# EAGLE design untitled (EAGLE 7.6.0)
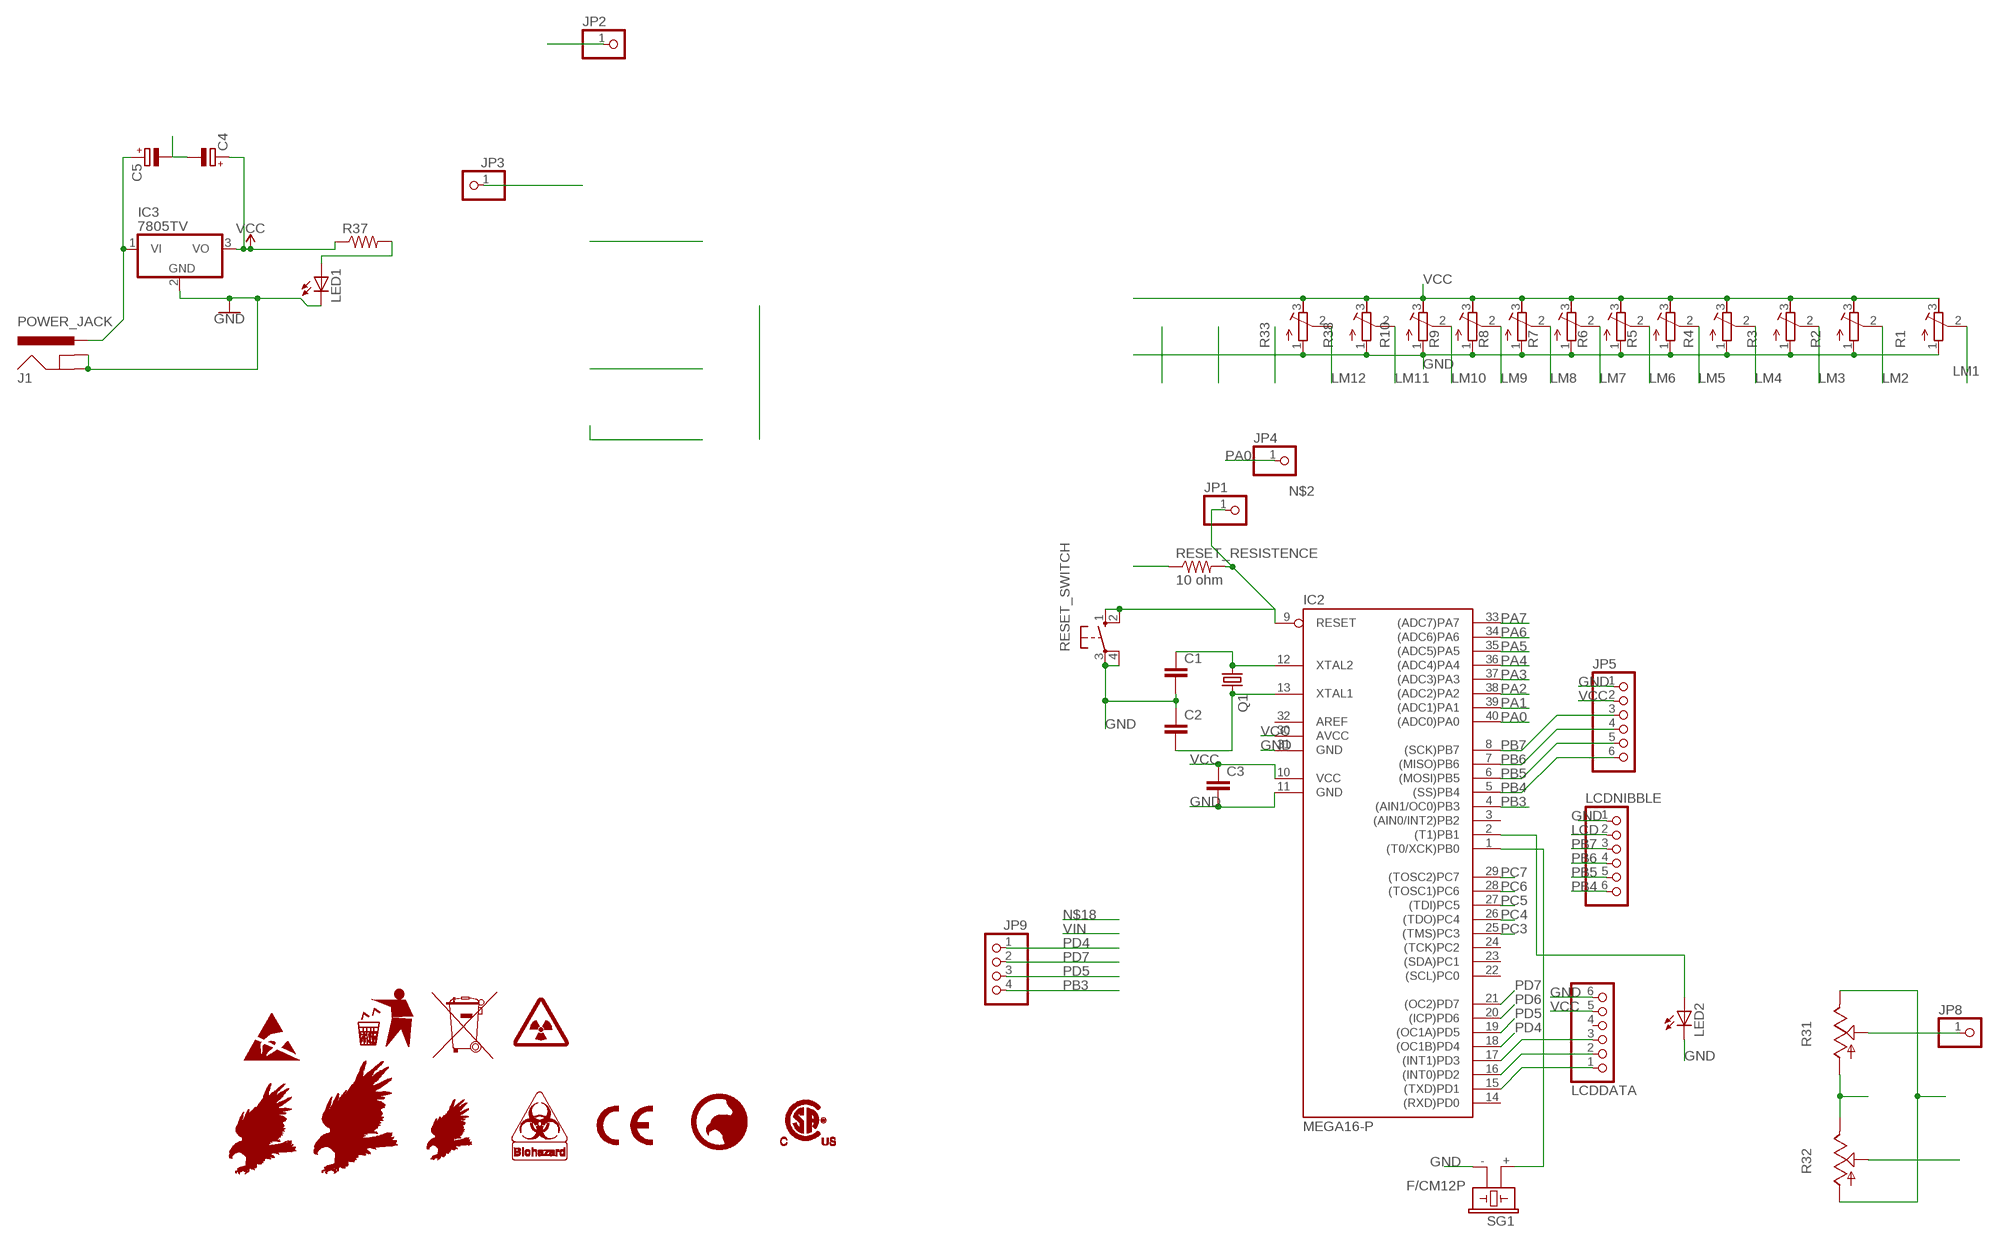
[diagram p0: schematic, sheet 1, part 1 of 2]
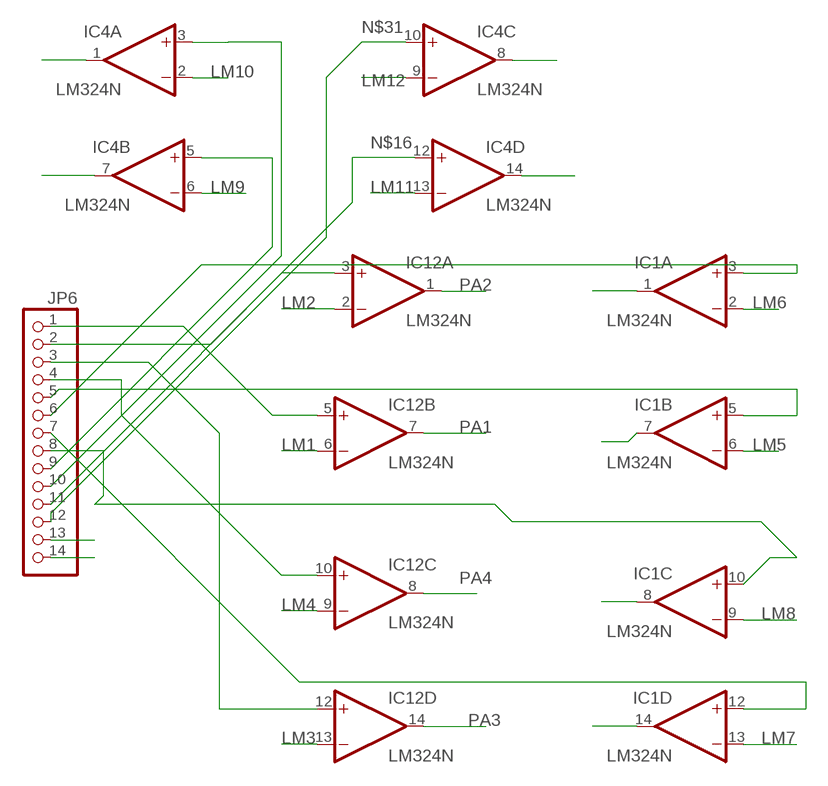
[diagram p1: schematic, sheet 1, part 2 of 2]

## Parts
C1  C-EU025-025X050  [C025-025X050]
C2  C-EU025-025X050  [C025-025X050]
C3  C-EU050-030X075  [C050-030X075]
C4  CPOL-EUE2.5-6  [E2,5-6]
C5  CPOL-EUE2.5-6  [E2,5-6]
IC1  LM324N  [DIL14]
IC2  MEGA16-P  [DIL40]
IC3  7805TV  [TO220V]
IC4  LM324N  [DIL14]
IC12  LM324N  [DIL14]
J1  POWER_JACK  [POWER_JACK_PTH]
JP1  PINHD-1X1  [1X01]
JP2  PINHD-1X1  [1X01]
JP3  PINHD-1X1  [1X01]
JP4  PINHD-1X1  [1X01]
JP5  PINHD-1X6  [1X06]
JP6  PINHD-1X14/90  [1X14/90]
JP8  PINHD-1X1  [1X01]
JP9  PINHD-1X4  [1X04]
LCDDATA  PINHD-1X6  [1X06]
LCDNIBBLE  PINHD-1X6  [1X06]
LED1  LED5MM  [LED5MM]
LED2  LED5MM  [LED5MM]
Q1  CRYSTALHC49U70  [HC49U70]
R1  R-TRIMM64W  [RTRIM64W]
R2  R-TRIMM64W  [RTRIM64W]
R3  R-TRIMM64W  [RTRIM64W]
R4  R-TRIMM64W  [RTRIM64W]
R5  R-TRIMM64W  [RTRIM64W]
R6  R-TRIMM64W  [RTRIM64W]
R7  R-TRIMM64W  [RTRIM64W]
R8  R-TRIMM64W  [RTRIM64W]
R9  R-TRIMM64W  [RTRIM64W]
R10  R-TRIMM64W  [RTRIM64W]
R31  TRIM_US-CA9V  [CA9V]
R32  TRIM_US-CA9V  [CA9V]
R33  R-TRIMM64W  [RTRIM64W]
R37  R-US_0204/7  [0204/7]
R38  R-TRIMM64W  [RTRIM64W]
RESET_RESISTENCE  10 ohm  R-US_0204/7  [0204/7]
RESET_SWITCH  10-XX  [B3F-10XX]
SG1  F/CM12P  [F/CM12P]

## Nets
GND: C1.2 C2.1 C3.2 C4.- C5.- IC2.11(GND) IC2.31(GND) IC3.2(GND) J1.GND J1.GNDBREAK JP2.1 JP5.1 JP6.14 LCDDATA.6 LCDNIBBLE.1 LED1.K(C) LED2.K(C) R1.1(A) R2.1(A) R3.1(A) R4.1(A) R5.1(A) R6.1(A) R7.1(A) R8.1(A) R9.1(A) R10.1(A) R31.A R32.E R33.1(A) R38.1(A) RESET_SWITCH.3(P) RESET_SWITCH.4(P1) SG1.-
LCD: LCDNIBBLE.2 R32.S
LM1: IC12.6(B:-IN) R1.2(S)
LM2: IC12.2(A:-IN) R2.2(S)
LM3: IC12.13(D:-IN) R3.2(S)
LM4: IC12.9(C:-IN) R4.2(S)
LM5: IC1.6(B:-IN) R5.2(S)
LM6: IC1.2(A:-IN) R6.2(S)
LM7: IC1.13(D:-IN) R7.2(S)
LM8: IC1.9(C:-IN) R8.2(S)
LM9: IC4.6(B:-IN) R9.2(S)
LM10: IC4.2(A:-IN) R10.2(S)
LM11: IC4.13(D:-IN) R38.2(S)
LM12: IC4.9(C:-IN) R33.2(S)
N$2: IC2.9(RESET) JP1.1 RESET_RESISTENCE.2 RESET_SWITCH.1(S) RESET_SWITCH.2(S1)
N$4: IC1.10(C:+IN) JP6.8
N$5: C1.1 IC2.12(XTAL2) Q1.1
N$6: C2.2 IC2.13(XTAL1) Q1.2
N$8: IC2.15((TXD)PD1) LCDDATA.1
N$9: IC2.16((INT0)PD2) LCDDATA.2
N$10: IC2.17((INT1)PD3) LCDDATA.3
N$11: IC12.12(D:+IN) JP6.3
N$13: IC12.10(C:+IN) JP6.4
N$14: IC12.5(B:+IN) JP6.1
N$15: IC12.3(A:+IN) JP6.2
N$16: IC4.12(D:+IN) JP6.11
N$19: C5.+ IC3.1(VI) J1.PWR
N$20: JP8.1 R31.S
N$22: LED1.A R37.2
N$23: IC2.1((T0/XCK)PB0) SG1.+
N$26: IC2.2((T1)PB1) LED2.A
N$31: IC4.10(C:+IN) JP6.12
N$33: IC1.3(A:+IN) JP6.6
N$35: IC1.5(B:+IN) JP6.5
N$39: IC1.12(D:+IN) JP6.7
N$41: IC4.3(A:+IN) JP6.10
N$43: IC4.5(B:+IN) JP6.9
PA0: IC2.40((ADC0)PA0) JP4.1
PA1: IC2.39((ADC1)PA1) IC12.7(B:OUT)
PA2: IC2.38((ADC2)PA2) IC12.1(A:OUT)
PA3: IC2.37((ADC3)PA3) IC12.14(D:OUT)
PA4: IC2.36((ADC4)PA4) IC12.8(C:OUT)
PA5: IC1.7(B:OUT) IC2.35((ADC5)PA5)
PA6: IC1.1(A:OUT) IC2.34((ADC6)PA6)
PA7: IC1.14(D:OUT) IC2.33((ADC7)PA7)
PB3: IC2.4((AIN1/OC0)PB3) JP9.4
PB4: IC2.5((SS)PB4) JP5.6 LCDNIBBLE.6
PB5: IC2.6((MOSI)PB5) JP5.5 LCDNIBBLE.5
PB6: IC2.7((MISO)PB6) JP5.4 LCDNIBBLE.4
PB7: IC2.8((SCK)PB7) JP5.3 LCDNIBBLE.3
PC3: IC2.25((TMS)PC3) IC4.8(C:OUT)
PC4: IC2.26((TDO)PC4) IC4.14(D:OUT)
PC5: IC2.27((TDI)PC5) IC4.1(A:OUT)
PC6: IC2.28((TOSC1)PC6) IC4.7(B:OUT)
PC7: IC1.8(C:OUT) IC2.29((TOSC2)PC7)
PD4: IC2.18((OC1B)PD4) JP9.1
PD5: IC2.19((OC1A)PD5) JP9.3
PD6: IC2.20((ICP)PD6)
PD7: IC2.21((OC2)PD7) JP9.2
VCC: C3.1 C4.+ IC2.10(VCC) IC2.30(AVCC) IC3.3(VO) JP3.1 JP5.2 JP6.13 LCDDATA.5 R1.3(E) R2.3(E) R3.3(E) R4.3(E) R5.3(E) R6.3(E) R7.3(E) R8.3(E) R9.3(E) R10.3(E) R31.E R32.A R33.3(E) R37.1 R38.3(E) RESET_RESISTENCE.1
Unconnected: IC2.3((AIN0/INT2)PB2) IC2.14((RXD)PD0) IC2.22((SCL)PC0) IC2.23((SDA)PC1) IC2.24((TCK)PC2) IC2.32(AREF) LCDDATA.4

## Power pins joined to a net without a drawn wire
V+: IC1.4(P:V+) IC4.4(P:V+) IC12.4(P:V+)
V-: IC1.11(P:V-) IC4.11(P:V-) IC12.11(P:V-)

## Library data of the parts
C1 C2 = resistor:C-EU: CAPACITOR, European symbol
C3 = rcl:C-EU: CAPACITOR, European symbol
C4 C5 = resistor:CPOL-EU: POLARIZED CAPACITOR, European symbol
IC1 IC4 IC12 = linear:LM324: OP AMP
IC2 = atmel:MEGA16-P: MICROCONTROLLER 16 Kbytes FLASH 1 kbytes SRAM 512 bytes EEPROM USART 8-channel 10 bit ADC Source: avr.lbr; MPN: ATMEGA16-16PU; OC_FARNELL: 9171142; OC_NEWARK: 01M6885
IC3 = linear:78*: Positive VOLTAGE REGULATOR Source: http://cache.national.com/ds/LM/LM78L05.pdf http://www.fairchildsemi.com/ds/LM/LM7805.pdf
J1 = SparkFun-Connectors:POWER_JACK: Power Jack Connector This is the standard 5.5mm barrel jack for power. The PTH is the most common, proven, reliable, footprint. The Slot footprint only works if the mill layer is transmitted to the PCB fab house so be warned. Here are the connectors we sell at SparkFun: DC Barrel Power Jack/Connector <https://www.sparkfun.com/products/119> (PRT-00119) DC Barrel Power Jack/Connector (SMD) <https://www.sparkfun.com/products/12748> (PRT-12748) DC Barrel Jack Adapter - Breadboard Compatible <https://www.sparkfun.com/products/10811> (PRT-10811) It is used on this SparkFun product (and many, many others): SparkFun RedBoard - Programmed with Arduino <https://www.sparkfun.com/products/12757> (DEV-12757) Also, if you need a mating power supply or connector, please check these out: Wall Adapter Power Supply - 9VDC 650mA <https://www.sparkfun.com/products/298> (TOL-00298) DC Barrel Jack Adapter - Male <https://www.sparkfun.com/products/10287> (PRT-10287); PROD_ID: CONN-08197
JP1-JP4 JP8 = pinhead:PINHD-1X1: PIN HEADER
JP5 LCDDATA LCDNIBBLE = pinhead:PINHD-1X6: PIN HEADER
JP6 = pinhead:PINHD-1X14: PIN HEADER
JP9 = pinhead:PINHD-1X4: PIN HEADER
LED1 LED2 = led:LED: LED OSRAM: - CHIPLED LG R971, LG N971, LY N971, LG Q971, LY Q971, LO R971, LY R971 LH N974, LH R974 LS Q976, LO Q976, LY Q976 LO Q996 - Hyper CHIPLED LW Q18S LB Q993, LB Q99A, LB R99A - SideLED LS A670, LO A670, LY A670, LG A670, LP A670 LB A673, LV A673, LT A673, LW A673 LH A674 LY A675 LS A676, LA A676, LO A676, LY A676, LW A676 LS A679, LY A679, LG A679 - Hyper Micro SIDELED® LS Y876, LA Y876, LO Y876, LY Y876 LT Y87S - SmartLED LW L88C, LW L88S LB L89C, LB L89S, LG L890 LS L89K, LO L89K, LY L89K LS L896, LA L896, LO L896, LY L896 - TOPLED LS T670, LO T670, LY T670, LG T670, LP T670 LSG T670, LSP T670, LSY T670, LOP T670, LYG T670 LG T671, LOG T671, LSG T671 LB T673, LV T673, LT T673, LW T673 LH T674 LS T676, LA T676, LO T676, LY T676, LB T676, LH T676, LSB T676, LW T676 LB T67C, LV T67C, LT T67C, LS T67K, LO T67K, LY T67K, LW E67C LS E67B, LA E67B, LO E67B, LY E67B, LB E67C, LV E67C, LT E67C LW T67C LS T679, LY T679, LG T679 LS T770, LO T770, LY T770, LG T770, LP T770 LB T773, LV T773, LT T773, LW T773 LH T774 LS E675, LA E675, LY E675, LS T675 LS T776, LA T776, LO T776, LY T776, LB T776 LHGB T686 LT T68C, LB T68C - Hyper Mini TOPLED® LB M676 - Mini TOPLED Santana® LG M470 LS M47K, LO M47K, LY M47K Source: http://www.osram.convergy.de LUXEON: - LUMILED® LXK2-PW12-R00, LXK2-PW12-S00, LXK2-PW14-U00, LXK2-PW14-V00 LXK2-PM12-R00, LXK2-PM12-S00, LXK2-PM14-U00 LXK2-PE12-Q00, LXK2-PE12-R00, LXK2-PE12-S00, LXK2-PE14-T00, LXK2-PE14-U00 LXK2-PB12-K00, LXK2-PB12-L00, LXK2-PB12-M00, LXK2-PB14-N00, LXK2-PB14-P00, LXK2-PB14-Q00 LXK2-PR12-L00, LXK2-PR12-M00, LXK2-PR14-Q00, LXK2-PR14-R00 LXK2-PD12-Q00, LXK2-PD12-R00, LXK2-PD12-S00 LXK2-PH12-R00, LXK2-PH12-S00 LXK2-PL12-P00, LXK2-PL12-Q00, LXK2-PL12-R00 Source: www.luxeon.com KINGBRIGHT: KA-3528ASYC Source: www.kingbright.com
Q1 = crystal:CRYSTAL: CRYSTAL; OC_FARNELL: unknown; OC_NEWARK: unknown
R1-R10 R33 R38 = resistor:R-TRIMM: Trimm resistor
R31 R32 = pot:TRIM_US-: POTENTIOMETER
R37 RESET_RESISTENCE = resistor:R-US_: RESISTOR, American symbol
RESET_SWITCH = switch-omron:10-XX: OMRON SWITCH; MPN: B3F-1000; OC_FARNELL: 176432; OC_NEWARK: 36M3542
SG1 = buzzer:F/CM12P: BUZZER Source: Buerklin; OC_FARNELL: unknown; OC_NEWARK: unknown

## Board
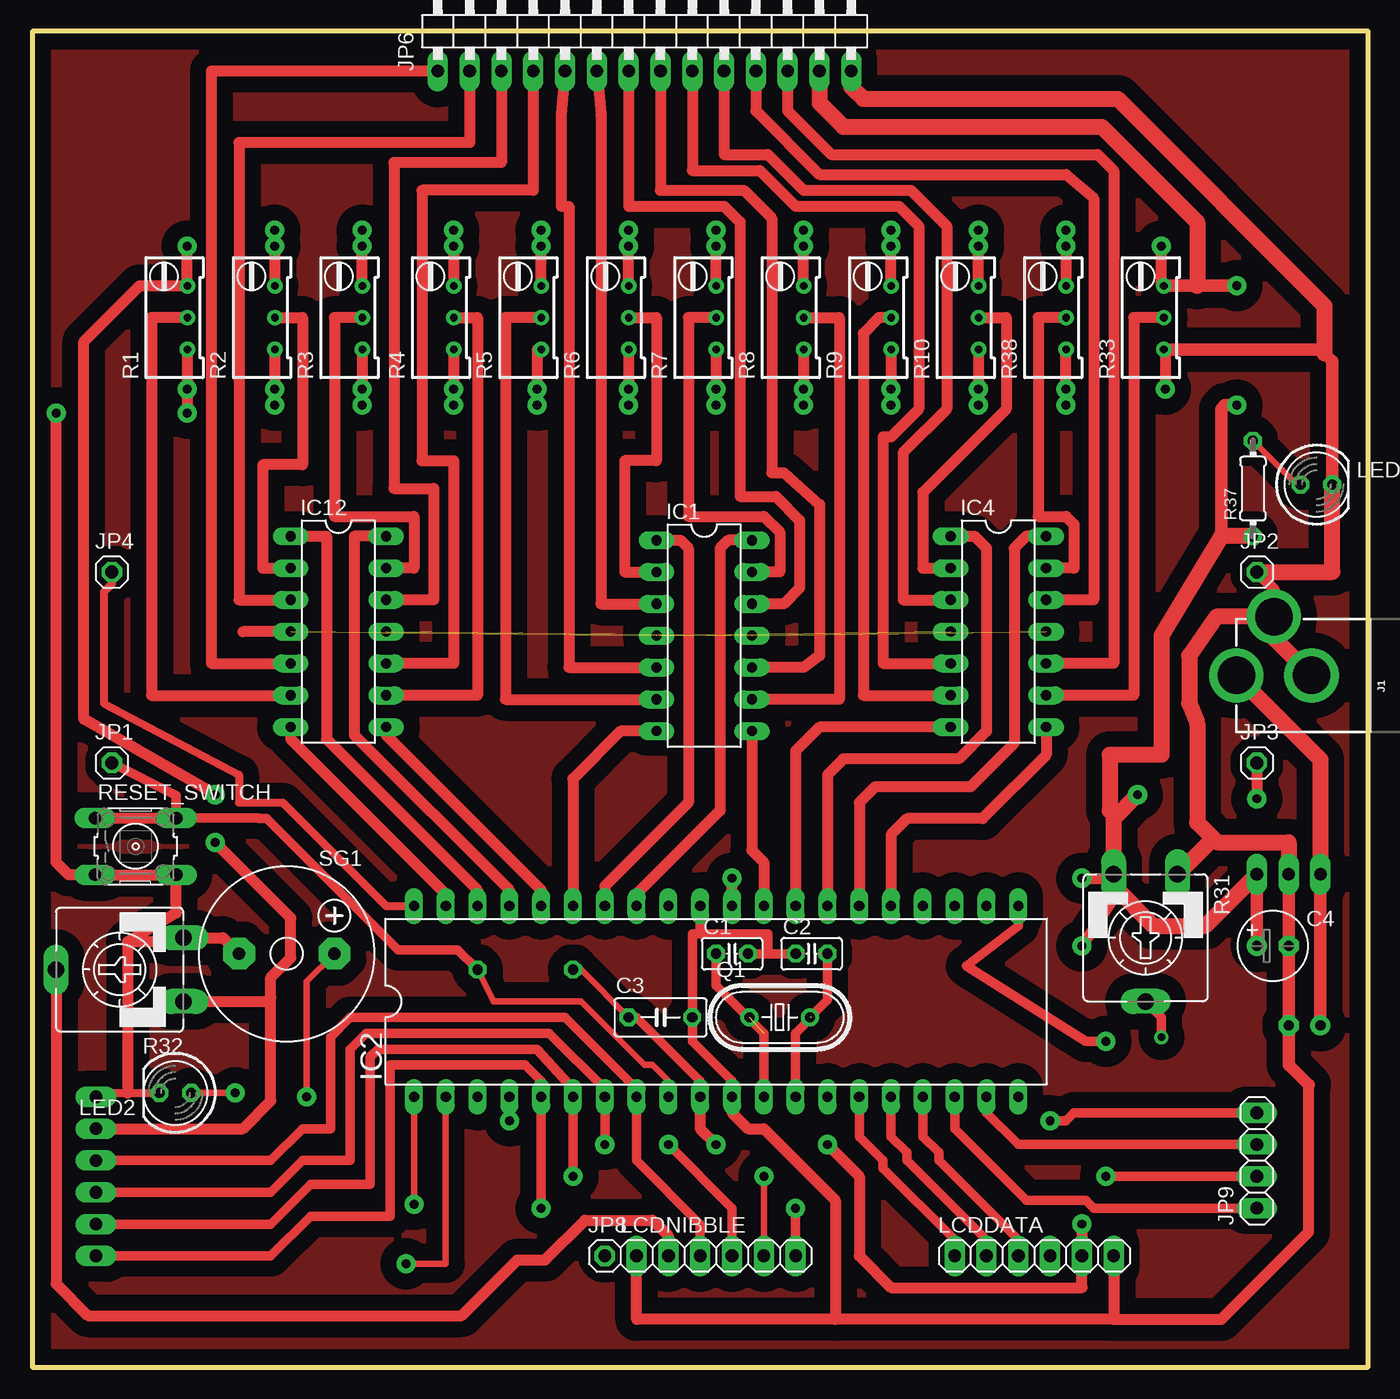
[diagram p2: board, top side]
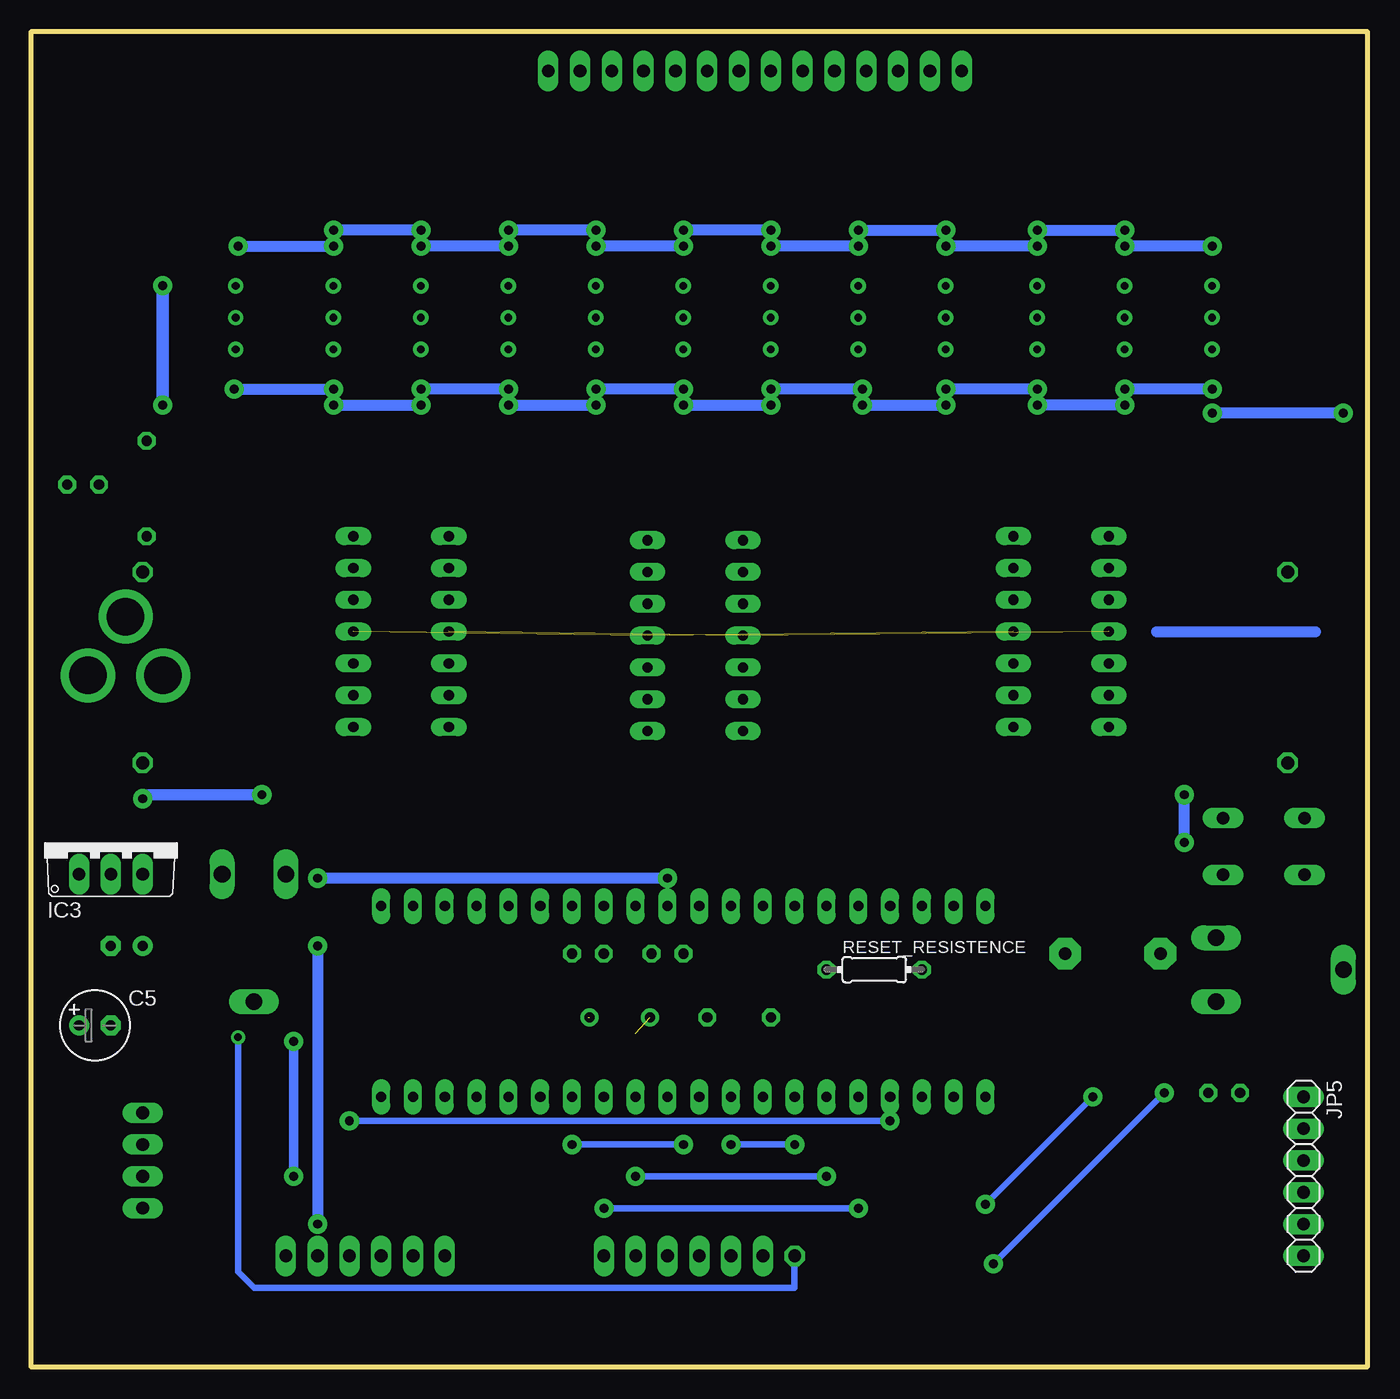
[diagram p3: board, bottom side, seen from below]

Size 106.68 x 106.68 mm. Coordinates in mm from the lower left corner, seen from the top.
Outline: 0,0 106.68,0 106.68,106.68 0,106.68 0,0
Copper layers (1*16): Top 0.035mm / dielectric 1.5mm / Bottom 0.035mm
Design rules "SparkFun": minimum track width 8mil, minimum drill 20mil, track to track 8mil, track to pad 8mil, pad to pad 8mil, via to via 8mil, smd to smd 8mil, copper to edge 8mil, drill to drill 8mil, minimum pad ring 12mil, minimum via ring 10mil, stop-mask expansion 4mil, vias tented up to drill 20mil, thermal gap 10mil

### Footprints (pad centres in the part's own frame; a part is rotated, then mirrored left to right if it is on the bottom)
C025-025X050 = drill 0.813 octagon: 1 -1.27,0; 2 1.27,0
C050-030X075 = drill 0.813 octagon: 1 -2.54,0; 2 2.54,0
E2,5-6 = drill 0.813 pad 1.6: + -1.27,0 | drill 0.813 pad 1.6 octagon: - 1.27,0
DIL14 = drill 0.813 long: 1 -7.62,-3.81; 2 -5.08,-3.81; 3 -2.54,-3.81; 4 0,-3.81; 5 2.54,-3.81; 6 5.08,-3.81; 7 7.62,-3.81; 8 7.62,3.81; 9 5.08,3.81; 10 2.54,3.81; 11 0,3.81; 12 -2.54,3.81; 13 -5.08,3.81; 14 -7.62,3.81
DIL40 = drill 0.813 long: 1 -24.13,-7.62; 2 -21.59,-7.62; 3 -19.05,-7.62; 4 -16.51,-7.62; 5 -13.97,-7.62; 6 -11.43,-7.62; 7 -8.89,-7.62; 8 -6.35,-7.62; 9 -3.81,-7.62; 10 -1.27,-7.62; 11 1.27,-7.62; 12 3.81,-7.62; 13 6.35,-7.62; 14 8.89,-7.62; 15 11.43,-7.62; 16 13.97,-7.62; 17 16.51,-7.62; 18 19.05,-7.62; 19 21.59,-7.62; 20 24.13,-7.62; 21 24.13,7.62; 22 21.59,7.62; 23 19.05,7.62; 24 16.51,7.62; 25 13.97,7.62; 26 11.43,7.62; 27 8.89,7.62; 28 6.35,7.62; 29 3.81,7.62; 30 1.27,7.62; 31 -1.27,7.62; 32 -3.81,7.62; 33 -6.35,7.62; 34 -8.89,7.62; 35 -11.43,7.62; 36 -13.97,7.62; 37 -16.51,7.62; 38 -19.05,7.62; 39 -21.59,7.62; 40 -24.13,7.62
TO220V = drill 1.016 long: 1 -2.54,-2.54; 2 0,-2.54; 3 2.54,-2.54
POWER_JACK_PTH = drill 2.997 pad 4.318: GND 0,7.7; GNDBREAK 4.7,10.7; PWR 0,13.7
1X01 = drill 1.016 octagon: 1 0,0
1X06 = drill 1.016 long: 1 -6.35,0; 2 -3.81,0; 3 -1.27,0; 4 1.27,0; 5 3.81,0; 6 6.35,0
1X14/90 = drill 1.016 long: 1 -16.51,-3.81; 2 -13.97,-3.81; 3 -11.43,-3.81; 4 -8.89,-3.81; 5 -6.35,-3.81; 6 -3.81,-3.81; 7 -1.27,-3.81; 8 1.27,-3.81; 9 3.81,-3.81; 10 6.35,-3.81; 11 8.89,-3.81; 12 11.43,-3.81; 13 13.97,-3.81; 14 16.51,-3.81
1X04 = drill 1.016 long: 1 -3.81,0; 2 -1.27,0; 3 1.27,0; 4 3.81,0
LED5MM = drill 0.813 octagon: A -1.27,0; K 1.27,0
HC49U70 = drill 0.813: 1 -2.413,0; 2 2.413,0
RTRIM64W = drill 0.61: 1 1.27,-2.54; 2 1.27,0; 3 1.27,2.54
CA9V = drill 1.321 long: A -2.54,-5.08; E 2.54,-5.08; S 0,5.08
0204/7 = drill 0.813 octagon: 1 -3.81,0; 2 3.81,0
B3F-10XX = drill 1.016 long: 1 -3.251,2.261; 2 3.251,2.261; 3 -3.251,-2.261; 4 3.251,-2.261
F/CM12P = drill 1.016 pad 2.54 octagon: + 3.81,0; - -3.81,0

### Placement (x,y rotation side)
C1  55.88,33.02 0 top
C2  62.23,33.02 0 top
C3  50.16,27.94 0 top
C4  99.06,33.66 0 top
C5  101.6,27.31 0 bottom
IC1  53.66,58.42 270 top
IC2  54.61,29.21 0 top
IC3  100.33,41.91 0 bottom
IC4  77.15,58.74 270 top
IC12  24.45,58.74 270 top
J1  109.86,55.25 90 top
JP1  6.35,48.26 0 top
JP2  97.79,63.5 0 top
JP3  97.79,48.26 0 top
JP4  6.35,63.5 0 top
JP5  5.08,15.24 270 bottom
JP6  48.9,107.31 0 top
JP8  45.72,8.89 0 top
JP9  97.79,16.51 90 top
LCDDATA  80.01,8.89 0 top
LCDNIBBLE  54.61,8.89 0 top
LED1  102.55,70.48 0 top
LED2  11.43,21.91 180 top
Q1  59.69,27.94 0 top
R1  11.11,83.82 0 top
R2  18.1,83.82 0 top
R3  25.08,83.82 0 top
R4  32.38,83.82 0 top
R5  39.37,83.82 0 top
R6  46.35,83.82 0 top
R7  53.34,83.82 0 top
R8  60.32,83.82 0 top
R9  67.31,83.82 0 top
R10  74.29,83.82 0 top
R31  88.9,34.29 180 top
R32  6.98,31.75 90 top
R33  89.09,83.82 0 top
R37  97.47,70.17 90 top
R38  81.28,83.82 0 top
RESET_RESISTENCE  39.37,31.75 0 bottom
RESET_SWITCH  8.26,41.59 0 top
SG1  20.32,33.02 0 top

### Tracks (layer width: path | path; a pad name or v marks a point on that pad's centre or on a via)
GND  (via drill 0.71 pad 1.52)
  Top 0.635: JP5.1 5.4,21.91 7.62,21.91 LED2.K
  Top 0.762: C2.1 C1.2 58.74,33.02 58.74,34.61 53.34,34.61 | 53.34,34.61 52.71,34.61 C3.2 52.71,26.04 55.88,22.86 IC2.11 | 53.34,34.61 IC2.31
  Top 0.889: 86.36,3.81 64.13,3.81 | 64.13,3.81 48.26,3.81 LCDNIBBLE.1 | IC2.11 55.88,20.32 57.15,19.05 58.42,19.05 64.13,13.34 64.13,3.81 | LCDDATA.6 86.36,3.81 | 86.36,3.81 94.93,3.81 101.92,10.79 101.92,22.54 | JP2.1 99.16,62.14 J1.GNDBREAK | 7.62,33.97 11.75,33.97 R32.E 15.24,34.29 SG1.- | 7.62,33.97 7.62,21.91 | 7.62,33.97 11.51,36.27 RESET_SWITCH.4 RESET_SWITCH.3 2.9,39.33 1.91,40.32 v1.91,76.2 | R33.1 90.49,81.28 v90.49,78.11 | R38.1 v82.55,78.11 v82.55,76.84 | R10.1 v75.56,78.11 v75.56,76.84 | v68.58,76.84 v68.58,78.11 R9.1 | R8.1 v61.6,78.11 v61.6,76.84 | R7.1 v54.61,78.11 v54.61,76.84 | R6.1 v47.63,78.11 v47.63,76.84 | R5.1 40.32,81.28 v40.32,78.11 v40.32,76.84 | R4.1 v33.65,78.11 v33.65,76.84 | R3.1 v26.35,78.11 v26.35,76.84 | R2.1 v19.37,78.11 v19.37,76.84 | R1.1 v12.38,78.11 v12.38,76.2
  Top 1.016: IC3.2 C4.- C5.- 100.33,24.13 101.92,22.54 | R33.1 102.87,81.28 103.19,80.96 103.82,80.33 LED1.K
  Top 1.27: J1.GND 99.16,58.25 J1.GNDBREAK 94.55,59.95 92.39,56.83 92.39,53.02 93.03,51.44 93.03,43.5 94.3,42.23 | 94.3,42.23 94.62,41.91 100.33,41.91 IC3.2 | R31.A 94.3,42.23 | JP2.1 103.82,63.5 LED1.K | JP6.14 65.41,102.23 66.36,101.28 86.68,101.28 103.19,84.77 103.19,80.96
  Bottom 0.889: v90.49,78.11 v82.55,78.11 | v82.55,76.84 v75.56,76.84 | v68.58,76.84 v61.6,76.84 | v68.58,78.11 v75.56,78.11 | v54.61,78.11 v61.6,78.11 | v54.61,76.84 v47.63,76.84 | v26.35,78.11 v33.65,78.11 | v40.32,78.11 v47.63,78.11 | v40.32,76.84 v33.65,76.84 | v19.37,76.84 v26.35,76.84 | v12.38,78.11 v19.37,78.11 | v1.91,76.2 v12.38,76.2
LCD
  Top 0.889: R32.S 1.91,6.67 4.45,4.13 34.29,4.13 38.74,8.57 40.96,8.57 44.13,11.75 49.53,11.75 50.8,10.48 LCDNIBBLE.2
LM1
  Top 0.889: R1.2 9.52,83.82 9.52,53.66 IC12.6
LM2
  Top 0.889: R2.2 21.59,83.82 21.59,72.07 18.41,72.07 18.41,63.82 IC12.2
LM3
  Top 0.889: R3.2 24.13,83.82 24.13,67.95 30.48,67.95 30.48,63.82 IC12.13
LM4
  Top 0.889: R4.2 35.56,83.82 35.56,53.66 IC12.9
LM5
  Top 0.889: R5.2 37.78,83.82 37.78,53.34 IC1.6
LM6
  Top 0.889: R6.2 49.85,83.82 49.85,72.39 47.31,72.39 47.31,63.5 IC1.2
LM7
  Top 0.889: R7.2 52.39,83.82 52.39,67.95 58.42,67.95 59.69,66.68 59.69,63.5 IC1.13
LM8
  Top 0.889: R8.2 64.45,83.82 64.45,53.34 IC1.9
LM9
  Top 0.889: R9.2 67.63,83.82 66.36,82.55 66.36,53.66 IC4.6
LM10
  Top 0.889: R10.2 77.79,83.82 77.79,76.52 71.12,69.85 71.12,63.82 IC4.2
LM11
  Top 0.889: R38.2 80.33,83.82 80.33,67.95 82.55,67.95 83.19,67.31 83.19,63.82 IC4.13
LM12
  Top 0.889: R33.2 87.95,83.82 87.95,53.66 IC4.9
N$1
  Bottom 0.889: 16.83,58.74 4.13,58.74
N$2
  Top 0.508: RESET_RESISTENCE.2 36.83,29.21 43.82,29.21 48.9,24.13 49.53,24.13 50.8,22.86 IC2.9
  Top 0.762: JP1.1 11.51,45.64 RESET_SWITCH.2 18.06,43.85 18.1,43.81 18.73,43.81 29.21,33.34 33.97,33.34 RESET_RESISTENCE.2
  Top 0.889: RESET_SWITCH.1 RESET_SWITCH.2
N$3
  pour Top (isolate 1.27): 0,0 106.68,0 106.68,106.68 0,106.68
N$4
  Top 0.889: JP6.8 50.16,93.98 56.83,93.98 59.05,91.76 59.05,71.44 60.01,71.44 62.87,68.9 62.87,56.83 61.6,55.88 IC1.10
N$5  (1 unrouted)
  Top 0.762: IC2.12 58.42,26.67 54.61,30.48 C1.1
N$6  (1 unrouted)
  Top 0.762: IC2.13 60.96,26.67 62.23,27.94 | Q1.2 63.5,29.34 C2.2
N$8
  Top 0.762: IC2.15 66.04,18.42 67.94,16.51 67.94,15.88 73.66,10.16 LCDDATA.1
N$9
  Top 0.762: IC2.16 68.58,18.42 69.85,17.14 69.85,16.51 76.2,10.16 LCDDATA.2
N$10
  Top 0.762: IC2.17 71.12,18.42 72.39,17.14 72.39,16.51 78.74,10.16 LCDDATA.3
N$11
  Top 0.889: JP6.3 37.46,96.2 28.89,96.2 28.89,70.17 32.07,70.17 32.07,61.28 IC12.12
N$13
  Top 0.889: JP6.4 40.01,93.98 31.12,93.98 31.12,72.39 33.65,72.39 33.65,56.2 IC12.10
N$14
  Top 0.889: JP6.1 14.29,103.51 14.29,56.2 IC12.5
N$15
  Top 0.889: JP6.2 34.93,97.79 16.51,97.79 16.51,61.28 IC12.3
N$16
  Top 0.889: JP6.11 57.79,100.33 62.87,95.25 82.55,95.25 84.77,93.34 84.77,61.28 IC4.12
N$19
  Top 1.016: IC3.1 C5.+
  Top 1.27: J1.PWR 102.87,48.53 IC3.1
N$20  (via drill 0.6)
  Top 0.762: R31.S 90.17,27.94 v90.17,26.35
  Bottom 0.508: JP8.1 45.72,6.35 88.9,6.35 90.17,7.62 v90.17,26.35
N$22
  Top 0.508: R37.2 100.97,70.48 LED1.A
N$23  (via drill 0.71 pad 1.52)
  Top 0.508: SG1.+ 21.91,30.8 v21.91,21.59 | v30.48,13.02 IC2.1
  Bottom 0.508: v21.91,21.59 v30.48,13.02
N$26  (via drill 0.71 pad 1.52)
  Top 0.508: LED2.A v16.19,21.91 | v29.85,8.25 33.02,8.25 IC2.2
  Bottom 0.508: v16.19,21.91 v29.85,8.25
N$31
  Top 0.889: JP6.12 60.32,100.33 63.82,96.84 85.09,96.84 86.36,95.57 86.36,56.2 IC4.10
N$33
  Top 0.889: JP6.6 45.4,100.01 45.4,60.96 IC1.3
N$35
  Top 0.889: IC1.5 42.86,55.88 42.86,92.71 42.23,92.71 42.23,100.01 JP6.5
N$39
  Top 0.889: JP6.7 47.63,92.71 55.24,92.71 56.52,91.44 56.52,69.53 59.37,69.53 61.28,67.63 61.28,62.23 60.01,60.96 IC1.12
N$41
  Top 0.889: JP6.10 55.24,96.84 58.74,96.84 61.6,93.98 70.17,93.98 73.03,91.12 73.03,76.52 69.53,73.03 69.53,61.28 IC4.3
N$43
  Top 0.889: JP6.9 52.71,95.57 58.1,95.57 60.96,92.71 69.22,92.71 70.8,91.12 70.8,76.52 68.58,74.3 67.94,74.3 67.94,56.2 IC4.5
PA0
  Top 0.635: JP4.1 6.35,62.55 5.72,61.91 5.72,53.02 16.51,47.31 16.51,45.09 20,45.09 28.26,36.83 IC2.40
PA1
  Top 0.889: IC12.7 20.64,50.17 33.02,37.78 IC2.39
PA2
  Top 0.889: IC12.1 23.49,66.36 23.49,50.17 35.56,38.1 IC2.38
PA3
  Top 0.889: IC12.14 25.72,66.36 25.72,50.48 38.1,38.1 IC2.37
PA4
  Top 0.889: IC12.8 28.26,50.48 40.64,38.1 IC2.36
PA5
  Top 0.889: IC1.7 46.99,50.8 43.18,46.99 IC2.35
PA6
  Top 0.889: IC1.1 51.75,66.04 52.39,65.41 52.39,45.09 45.72,38.42 IC2.34
PA7
  Top 0.889: IC1.14 55.56,66.04 54.93,65.41 54.93,44.45 48.26,37.78 IC2.33
PB3  (via drill 0.71 pad 1.52)
  Top 0.508: IC2.4 v38.1,19.68
  Top 0.762: v81.28,19.68 82.55,19.68 83.19,20.32 JP9.4
  Bottom 0.508: v38.1,19.68 v81.28,19.68
PB4  (via drill 0.71 pad 1.52)
  Top 0.762: JP5.6 19.05,8.89 22.23,12.07 28.58,12.07 28.58,24.13 39.37,24.13 40.64,22.86 IC2.5 v40.64,12.7 | v60.96,12.7 LCDNIBBLE.6
  Bottom 0.508: v40.64,12.7 v60.96,12.7
PB5  (via drill 0.71 pad 1.52)
  Top 0.508: v58.42,15.24 LCDNIBBLE.5
  Top 0.762: JP5.5 19.05,11.43 22.23,14.61 26.99,14.61 26.99,24.77 27.62,25.4 40.32,25.4 43.18,22.22 IC2.6 v43.18,15.24
  Bottom 0.508: v43.18,15.24 v58.42,15.24
PB6  (via drill 0.71 pad 1.52)
  Top 0.762: JP5.4 19.05,13.97 21.59,16.51 25.4,16.51 25.4,25.4 26.67,26.67 41.27,26.67 45.72,22.22 IC2.7 v45.72,17.78 | v50.8,17.78 55.88,12.7 LCDNIBBLE.4
  Bottom 0.508: v45.72,17.78 v50.8,17.78
PB7
  Top 0.762: JP5.3 19.05,16.51 21.59,19.05 23.81,19.05 23.81,26.35 25.4,27.94 42.54,27.94 48.26,22.22 IC2.8 48.26,16.51 53.34,11.43 LCDNIBBLE.3
PC3
  Top 0.889: IC4.8 80.96,48.9 75.88,43.81 69.85,43.81 68.58,42.55 IC2.25
PC4
  Top 0.889: IC4.14 79.38,66.36 78.42,65.41 78.42,49.85 74.93,46.36 67.31,46.36 66.04,45.09 IC2.26
PC5
  Top 0.889: IC4.1 75.25,66.36 76.2,65.41 76.2,50.8 73.98,48.58 64.77,48.58 63.5,47.31 IC2.27
PC6
  Top 0.889: IC4.7 62.87,51.12 60.96,49.21 IC2.28
PC7
  Top 0.889: IC1.8 57.47,41.28 58.42,40.32 IC2.29
PD4
  Top 0.762: IC2.18 73.66,19.05 79.38,13.34 84.14,13.34 84.77,12.7 JP9.1
PD5
  Top 0.762: IC2.19 76.2,20.32 78.74,17.78 JP9.3
PD7  (via drill 0.71 pad 1.52)
  Top 0.762: IC2.21 78.74,35.24 74.61,32.07 84.14,26.04 v85.72,26.04 | v85.72,15.24 JP9.2
  Bottom 0.762: v85.72,26.04 v85.72,15.24
V+  (2 unrouted)
  Top 0.889: IC12.4 16.83,58.74
V-  (2 unrouted)
VCC  (via drill 0.71 pad 1.52)
  Top 0.508: RESET_RESISTENCE.1 43.82,31.75 C3.1
  Top 0.762: C3.1 48.26,27.94 53.34,22.86 IC2.10
  Top 0.889: IC2.10 53.34,19.05 v54.61,17.78 | v63.5,17.78 66.04,15.24 66.04,8.89 68.58,6.35 83.82,6.35 LCDDATA.5 v83.82,11.43 | v83.82,33.66 86.36,37.47 R31.E 86.04,39.05 v83.82,39.05 | JP3.1 v97.79,45.4 | IC2.30 v55.88,39.05 | R33.3 90.17,86.36 v90.17,89.54 | R38.3 v82.55,89.54 v82.55,90.81 | R10.3 v75.56,89.54 v75.56,90.81 | R9.3 v68.58,89.54 v68.58,90.81 | R8.3 v61.6,89.54 v61.6,90.81 | R7.3 v54.61,89.54 v54.61,90.81 | R6.3 v47.63,89.54 v47.63,90.81 | R5.3 v40.64,89.54 v40.64,90.81 | JP5.2 16.83,19.05 19.05,21.27 19.05,29.53 | 19.05,29.53 19.05,31.11 20.64,32.7 20.64,35.88 v14.61,41.91 | v14.61,45.72 4.13,51.75 4.13,81.92 8.57,86.36 R1.3 v12.38,89.54 | v33.65,90.81 v33.65,89.54 R4.3 | v26.35,90.81 v26.35,89.54 R3.3 | v19.37,90.81 v19.37,89.54 R2.3 | R32.A 18.73,29.21 19.05,29.53
  Top 1.016: IC3.3 C4.+ | v96.2,76.84 95.25,76.84 94.93,76.52 94.93,66.36 | R33.3 93.03,86.36 v96.2,86.36
  Top 1.27: IC3.3 93.66,35.24 89.53,35.24 86.36,38.42 R31.E 86.36,43.81 | 86.36,43.81 v88.27,45.72 | R37.1 94.93,66.36 90.17,58.42 90.17,48.9 86.04,48.9 86.04,44.45 86.36,44.13 86.36,43.81 | JP6.13 62.87,100.97 64.77,99.06 85.41,99.06 93.03,91.44 93.03,86.36
  Bottom 0.508: v54.61,17.78 v63.5,17.78
  Bottom 0.889: v83.82,33.66 v83.82,11.43 | v97.79,45.4 97.47,45.72 v88.27,45.72 | v55.88,39.05 v83.82,39.05 | v90.17,89.54 v82.55,89.54 | v75.56,90.81 v82.55,90.81 | v68.58,89.54 v75.56,89.54 | v61.6,90.81 v68.58,90.81 | v54.61,89.54 v61.6,89.54 | v47.63,90.81 v54.61,90.81 | v40.64,89.54 v47.63,89.54 | v14.61,41.91 v14.61,45.72 | v40.64,90.81 v33.65,90.81 | v26.35,90.81 v19.37,90.81 | v26.35,89.54 v33.65,89.54 | v12.38,89.54 v19.37,89.54
  Bottom 1.016: v96.2,86.36 v96.2,76.84